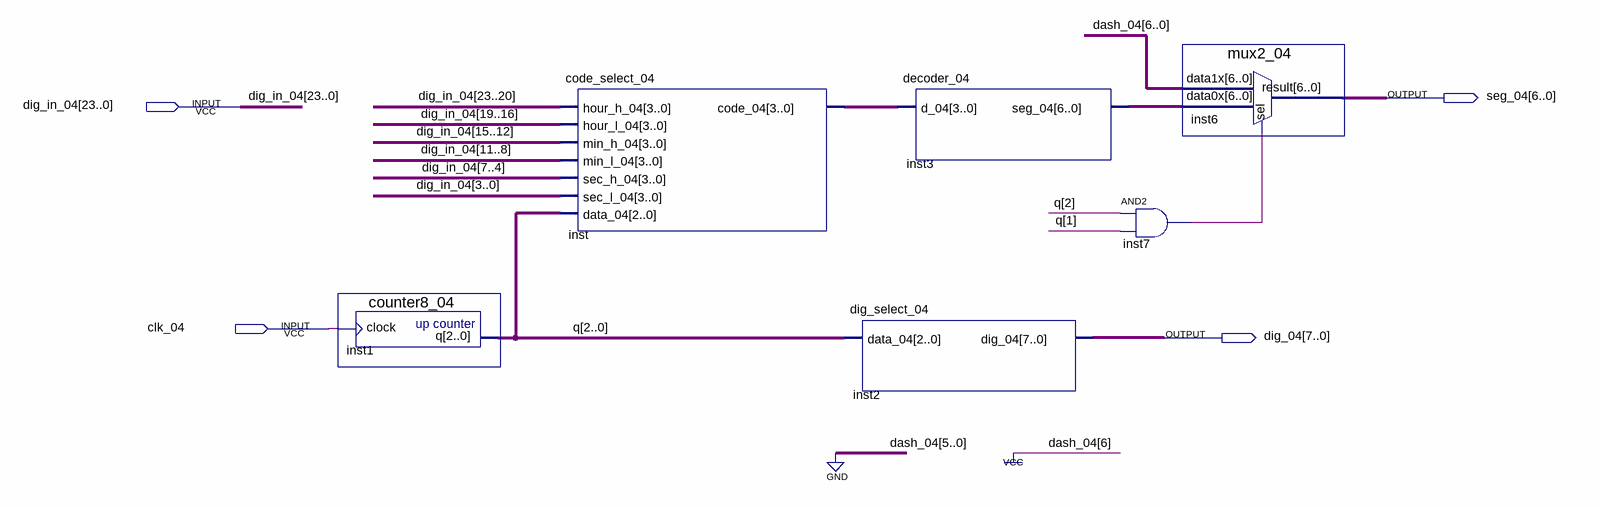
[diagram p0: schematic sheet]
// Quartus schematic display_04.bdf as structural Verilog: 6 symbols, 4 pins
module display_04 (
  input  [23:0] dig_in_04,
  input  clk_04,
  output [6:0] seg_04,
  output [7:0] dig_04
);

  wire inst7_out;
  wire [2:0] q;
  wire [3:0] inst_code_04;
  wire [6:0] inst3_seg_04;

  counter8_04 inst1 (.clock(clk_04), .q(q));
  code_select_04 inst (
    .hour_h_04(dig_in_04[23:20]), .hour_l_04(dig_in_04[19:16]), .min_h_04(dig_in_04[15:12]),
    .min_l_04(dig_in_04[11:8]), .sec_h_04(dig_in_04[7:4]), .sec_l_04(dig_in_04[3:0]), .data_04(q),
    .code_04(inst_code_04));
  dig_select_04 inst2 (.data_04(q), .dig_04(dig_04));
  decoder_04 inst3 (.d_04(inst_code_04), .seg_04(inst3_seg_04));
  and inst7 (inst7_out, q[2], q[1]);
  mux2_04 inst6 (.data1x(7'b1000000), .data0x(inst3_seg_04), .sel(inst7_out), .result(seg_04));
endmodule
